# Altium schematic sheet MIXER 2.SchDoc
size A4; SheetNumber: 5; SheetTotal: 12
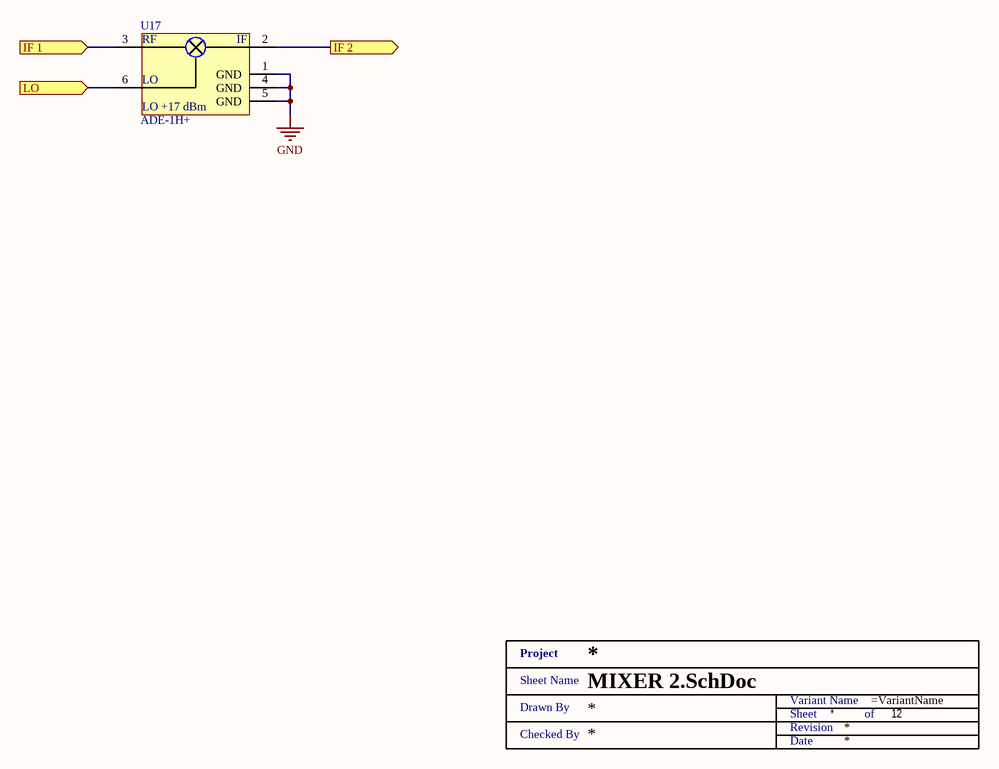
[diagram p0: MIXER 2.SchDoc]

## Parts
U17  ADE-1H+  [ADT1-6T]
XX?  Title 1  (value not drawn)  (graphical)

## Ports
IF 1 (in), IF 2 (out), LO (in)

## Nets
GND: U17.1(GND) U17.4(GND) U17.5(GND)
IF 1: U17.3(RF) ; port IF 1
IF 2: U17.2(IF) ; port IF 2
LO: U17.6(LO) ; port LO

## Notes on the sheet
- (in symbol ADE-1H+) LO +17 dBm
- (in symbol Title 1) Project; Sheet Name; Variant Name; Drawn By; Sheet; of; Revision; Checked By; Date

## Library data of the parts
U17 = ADE-1H+: RF Mixer, 0.50 to 500 MHz, SMT; Manufacturer: Mini-Circuits; Supplier 1: Mouser; Supplier Part Number 1: 139-ADE-1H; Manufacturer Part Number: ADE-1H+; RoHS: Yes; Category: RF Mixers; Stock 1: 949; Pricing 1: 1=8.29000, 10=7.49000, 50=7.14000, 100=6.20000, 1000=4.69000, 10000=4.69000 (USD); Supplier 2: Digi-Key; Supplier Part Number 2: 3157-ADE-1H+CT-ND